# Altium project customboard_v1.PrjPcb
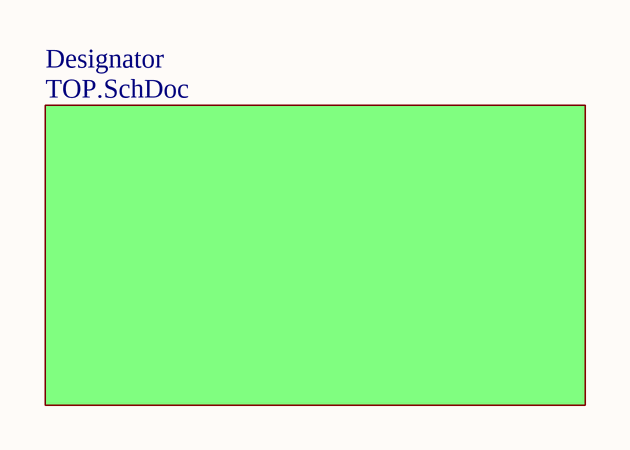
[diagram p0: project_overview.SchDoc]
5 sheets, 192 parts. Net scope: flat (ports and power ports of the same name join across sheets).
Sheets:
  project_overview.SchDoc
    Designator = TOP.SchDoc
      U_MCU = mcu.SchDoc
      U_Memory = sdram.SchDoc
      U_Power = power.SchDoc

## Sheet project_overview.SchDoc
size A3; SheetNumber: 1; SheetTotal: 6

### Sub-sheets
Designator = TOP.SchDoc: no entries

## Sheet TOP.SchDoc
size A3; SheetNumber: 2; SheetTotal: 6
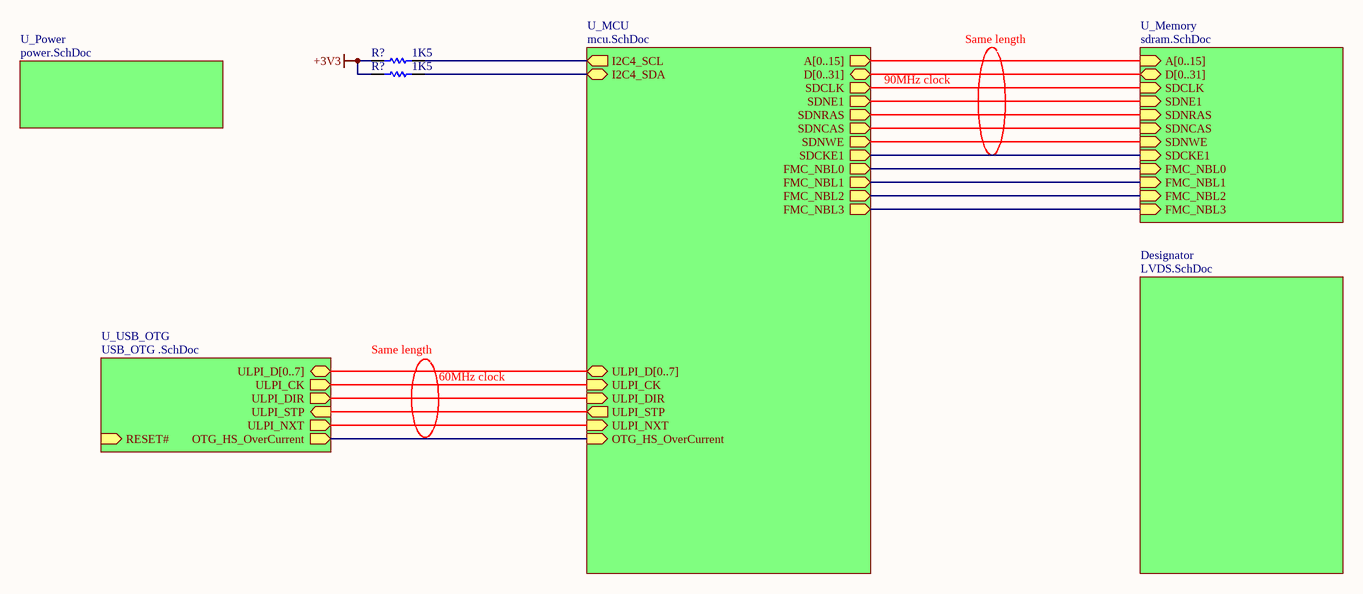
[diagram p1: TOP.SchDoc]

### Parts
(Parts that share a designator on the sheet are numbered #1, #2 ... from top to bottom, then left to right.)
R?#1  1K5  [0603R]
R?#2  1K5  [0603R]

### Sub-sheets
Designator = LVDS.SchDoc (file not in this document): no entries
U_MCU = mcu.SchDoc: ULPI_STP (out), FMC_NBL3 (out), FMC_NBL2 (out), FMC_NBL0 (out), FMC_NBL1 (out), SDNRAS (out), SDCLK (out), SDNCAS (out), SDCKE1 (out), SDNE1 (out), ULPI_NXT (in), SDNWE (out), D[0..31] (bidir), A[0..15] (out), ULPI_D[0..7] (bidir), ULPI_CK (in), I2C4_SCL (out), I2C4_SDA (bidir), OTG_HS_OverCurrent (in), ULPI_DIR (in)
U_Memory = sdram.SchDoc: FMC_NBL0 (in), FMC_NBL1 (in), D[0..31] (bidir), A[0..15] (in), SDNCAS (in), SDNWE (in), SDNRAS (in), SDNE1 (in), SDCKE1 (in), SDCLK (in), FMC_NBL3 (in), FMC_NBL2 (in)
U_Power = power.SchDoc: no entries
U_USB_OTG = USB_OTG .SchDoc (file not in this document): ULPI_D[0..7] (bidir), ULPI_CK (out), ULPI_DIR (out), ULPI_NXT (out), ULPI_STP (in), RESET# (in), OTG_HS_OverCurrent (out)

### Nets
+3V3: R?#1.1 R?#2.1
NetR?#1_2: R?#1.2 ; sheet U_MCU/I2C4_SCL
NetR?#2_2: R?#2.2 ; sheet U_MCU/I2C4_SDA
(unnamed): sheet U_MCU/ULPI_STP, sheet U_USB_OTG/ULPI_STP
(unnamed): sheet U_MCU/FMC_NBL3, sheet U_Memory/FMC_NBL3
(unnamed): sheet U_MCU/FMC_NBL2, sheet U_Memory/FMC_NBL2
(unnamed): sheet U_MCU/FMC_NBL0, sheet U_Memory/FMC_NBL0
(unnamed): sheet U_MCU/FMC_NBL1, sheet U_Memory/FMC_NBL1
(unnamed): sheet U_MCU/SDNRAS, sheet U_Memory/SDNRAS
(unnamed): sheet U_MCU/SDCLK, sheet U_Memory/SDCLK
(unnamed): sheet U_MCU/SDNCAS, sheet U_Memory/SDNCAS
(unnamed): sheet U_MCU/SDCKE1, sheet U_Memory/SDCKE1
(unnamed): sheet U_MCU/SDNE1, sheet U_Memory/SDNE1
(unnamed): sheet U_MCU/ULPI_NXT, sheet U_USB_OTG/ULPI_NXT
(unnamed): sheet U_MCU/SDNWE, sheet U_Memory/SDNWE
(unnamed): sheet U_MCU/ULPI_CK, sheet U_USB_OTG/ULPI_CK
(unnamed): sheet U_MCU/OTG_HS_OverCurrent, sheet U_USB_OTG/OTG_HS_OverCurrent
(unnamed): sheet U_MCU/ULPI_DIR, sheet U_USB_OTG/ULPI_DIR

### Buses and harness runs
bus sheet U_MCU/A[0..15] = sheet U_Memory/A[0..15]
bus sheet U_MCU/D[0..31] = sheet U_Memory/D[0..31]
bus sheet U_MCU/ULPI_D[0..7] = sheet U_USB_OTG/ULPI_D[0..7]

### Notes on the sheet
- 90MHz clock
- Same length
- 60MHz clock

### Library data of the parts
R?#1 R?#2 = Res1: Resistor; Value: 1K; Published: 8-Jun-2000; Revision: July-2002: Re-released for DXP Platform.; Publisher: Altium Limited

## Sheet mcu.SchDoc
size A3; SheetNumber: 3; SheetTotal: 5
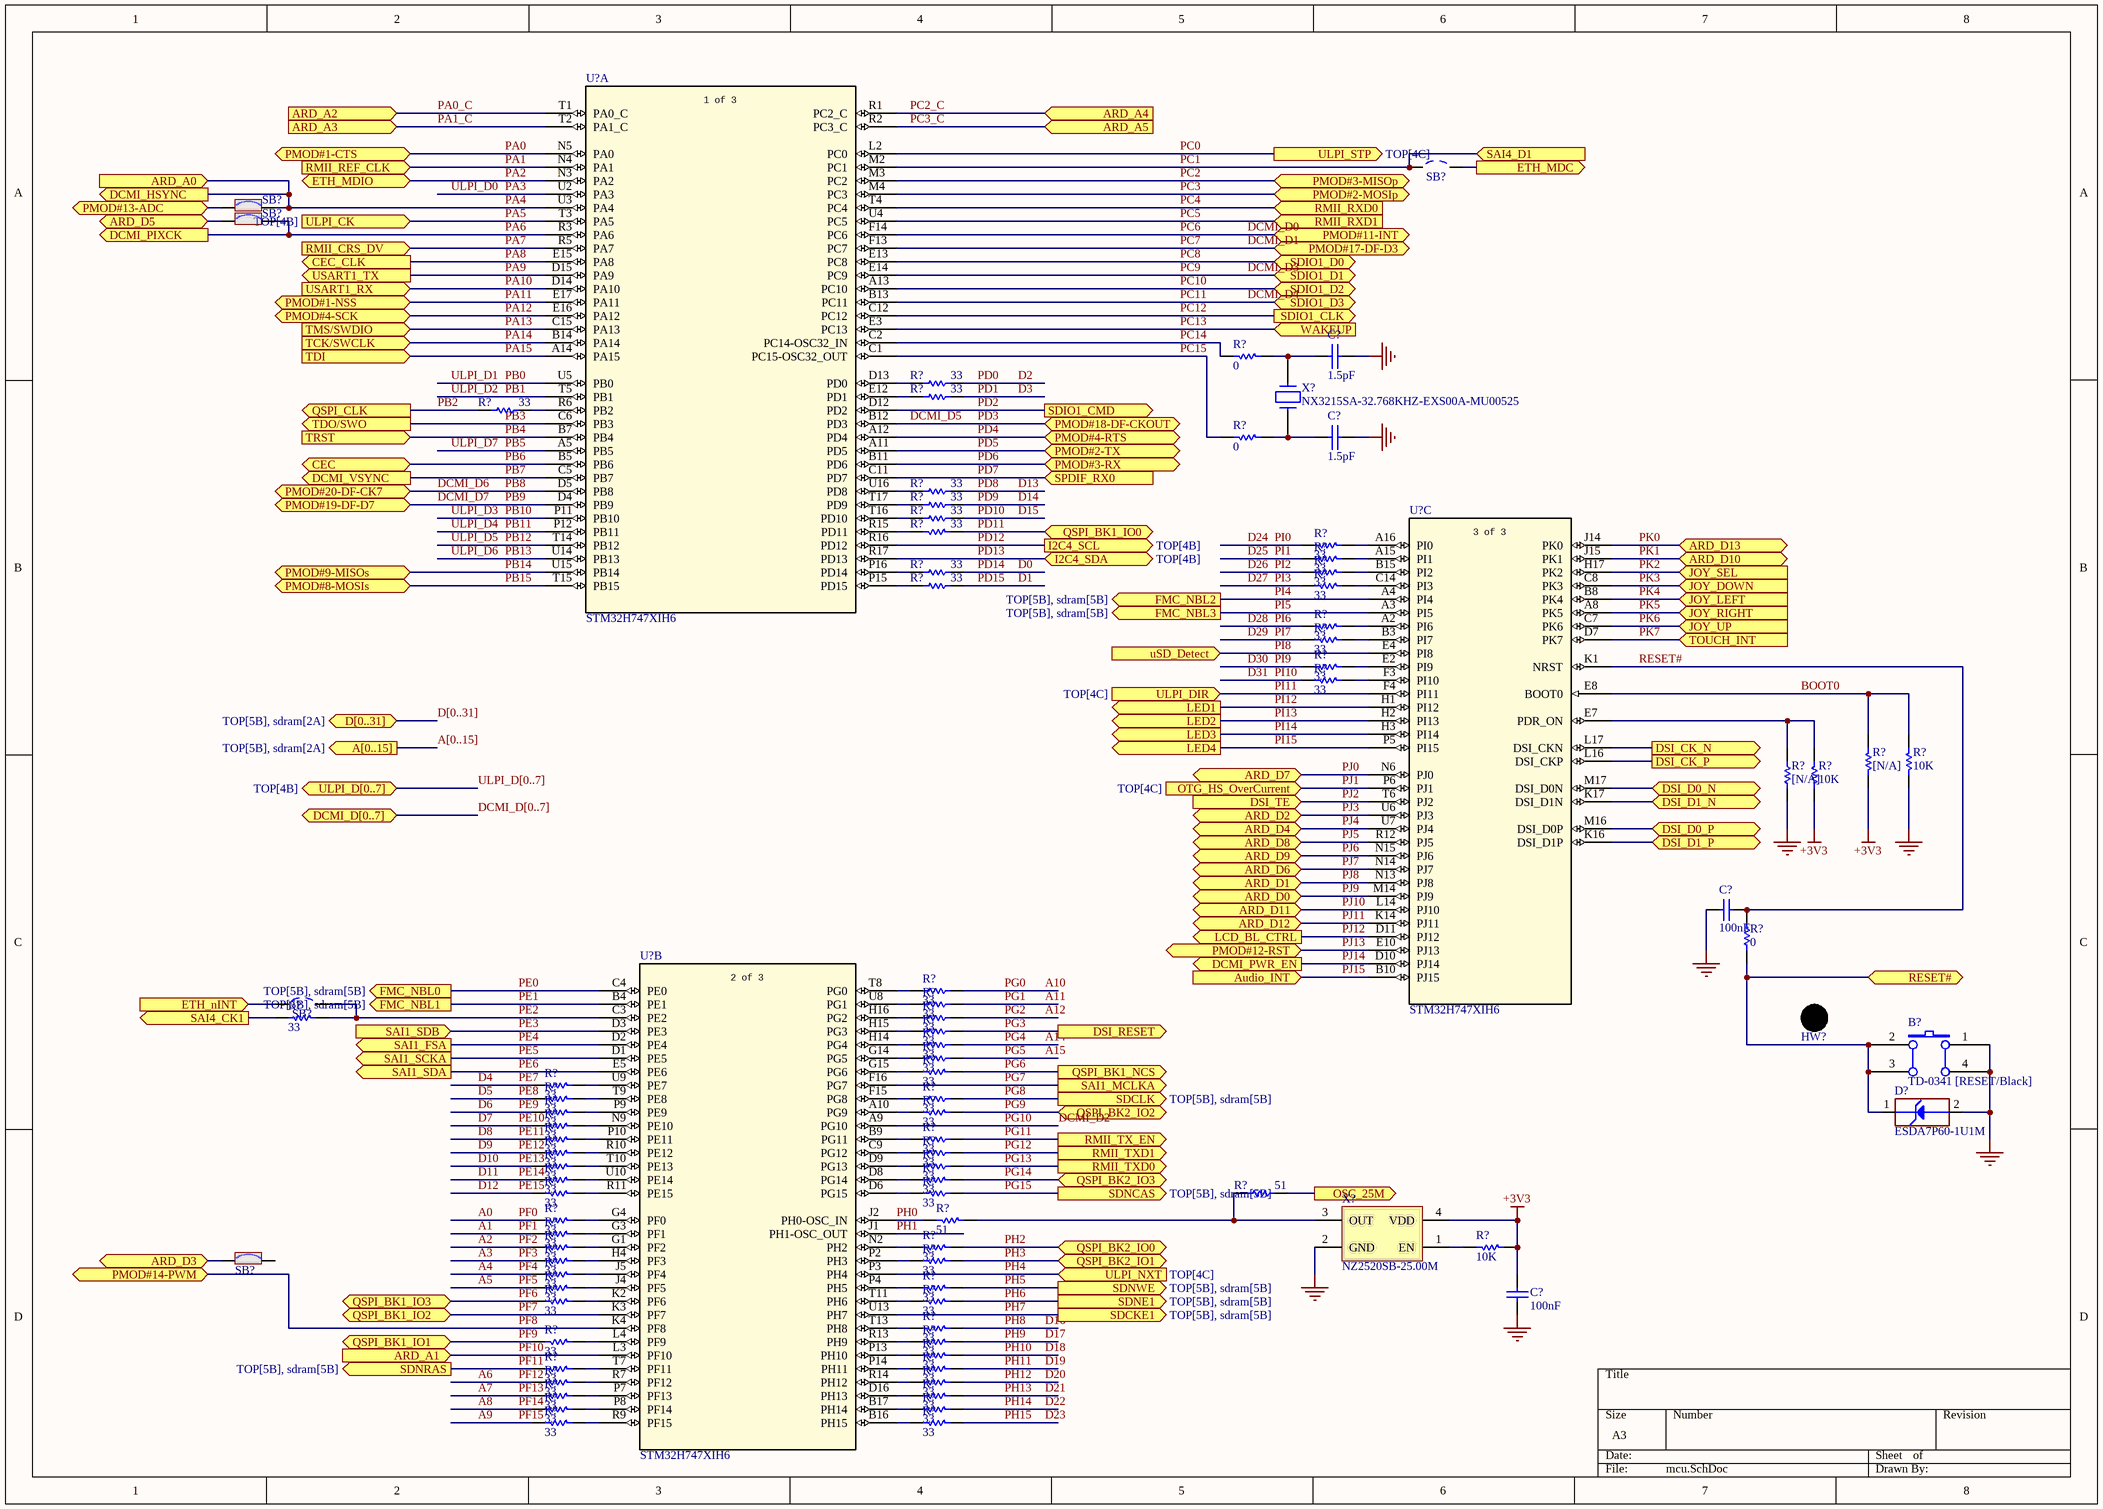
[diagram p2: mcu.SchDoc]

### Parts
(Parts that share a designator on the sheet are numbered #1, #2 ... from top to bottom, then left to right.)
B?  TD-0341 [RESET/Black]  [PB10]
C?#1  1.5pF  [CAP_C_1608X80]
C?#2  1.5pF  [CAP_C_1608X80]
C?#3  100nF  [CAP_C_1608X80]
C?#4  100nF  [CAP_C_1608X80]
D?  ESDA7P60-1U1M  [DIODE_ESDALC6V1-1U2]
HW?  SW-CAP-Black  (value not drawn)  (mechanical)
R?#3  0  [0402R]
R?#4  33  [0402R]
R?#5  33  [0402R]
R?#6  33  [0402R]
R?#7  0  [0402R]
R?#8  33  [0402R]
R?#9  33  [0402R]
R?#10  33  [0402R]
R?#11  33  [0402R]
R?#12  33  [0402R]
R?#13  33  [0402R]
R?#14  33  [0402R]
R?#15  33  [0402R]
R?#16  33  [0402R]
R?#17  33  [0402R]
R?#18  33  [0402R]
R?#19  33  [0402R]
R?#20  33  [0402R]
R?#21  33  [0402R]
R?#22  10K  [0603R]
R?#23  [N/A]  [0603R]
R?#24  [N/A]  [0603R]
R?#25  10K  [0603R]
R?#26  0  [0603R]
R?#27  33  [0402R]
R?#28  33  [0402R]
R?#29  33  [0402R]
R?#30  33  [0402R]
R?#31  33  [0402R]
R?#32  33  [0402R]
R?#33  33  [0402R]
R?#34  33  [0402R]
R?#35  33  [0402R]
R?#36  33  [0402R]
R?#37  33  [0402R]
R?#38  33  [0402R]
R?#39  33  [0402R]
R?#40  33  [0402R]
R?#41  33  [0402R]
R?#42  33  [0603R]
R?#43  33  [0402R]
R?#44  33  [0603R]
R?#45  33  [0402R]
R?#46  33  [0603R]
R?#47  33  [0402R]
R?#48  33  [0402R]
R?#49  33  [0402R]
R?#50  33  [0402R]
R?#51  51  [0603R]
R?#52  33  [0402R]
R?#53  51  [0603R]
R?#54  10K  [0603R]
R?#55  33  [0402R]
R?#56  33  [0402R]
R?#57  33  [0402R]
R?#58  33  [0402R]
R?#59  33  [0402R]
R?#60  33  [0402R]
R?#61  33  [0402R]
R?#62  33  [0402R]
R?#63  33  [0402R]
R?#64  33  [0402R]
R?#65  33  [0402R]
R?#66  33  [0402R]
R?#67  33  [0402R]
R?#68  33  [0402R]
R?#69  33  [0402R]
R?#70  33  [0402R]
R?#71  33  [0402R]
R?#72  33  [0402R]
R?#73  33  [0402R]
R?#74  33  [0402R]
R?#75  33  [0402R]
R?#76  33  [0402R]
R?#77  33  [0402R]
R?#78  33  [0402R]
SB?#1  Solder Bridge OFF  [SB_0603]  (value not drawn)
SB?#2  Solder Bridge ON  [Jump2]  (value not drawn)
SB?#3  Solder Bridge ON  [Jump2]  (value not drawn)
SB?#4  Solder Bridge OFF  [SB_0603]  (value not drawn)
SB?#5  Solder Bridge ON  [Jump2]  (value not drawn)
U?#1  STM32H747XIH6  [TFBGA240+25]  (part A of 4)
U?#2  STM32H747XIH6  [TFBGA240+25]  (part C of 4)
U?#3  STM32H747XIH6  [TFBGA240+25]  (part B of 4)
X?#1  NX3215SA-32.768KHZ-EXS00A-MU00525  [XTAL_MU00525_NDK]
X?#2  NZ2520SB-25.00M  [OSC_4SM_2R5X2]

### Ports
A[0..15] (out, see TOP[5B], sdram[2A]), ARD_A0 (in), ARD_A1 (in), ARD_A2 (in), ARD_A3 (in), ARD_A4 (in), ARD_A5 (in), ARD_D0 (bidir), ARD_D1 (bidir), ARD_D2 (bidir), ARD_D3 (bidir), ARD_D4 (bidir), ARD_D5 (bidir), ARD_D6 (bidir), ARD_D7 (bidir), ARD_D8 (bidir), ARD_D9 (bidir), ARD_D10 (bidir), ARD_D11 (bidir), ARD_D12 (bidir), ARD_D13 (bidir), Audio_INT (in), CEC (bidir), CEC_CLK (out), D[0..31] (bidir, see TOP[5B], sdram[2A]), DCMI_D[0..7] (bidir), DCMI_HSYNC (out), DCMI_PIXCK (out), DCMI_PWR_EN (out), DCMI_VSYNC (out), DSI_CK_N (out), DSI_CK_P (out), DSI_D0_N (bidir), DSI_D0_P (bidir), DSI_D1_N (bidir), DSI_D1_P (bidir), DSI_RESET (out), DSI_TE (in), ETH_MDC (out), ETH_MDIO (bidir), ETH_nINT (in), FMC_NBL0 (out, see TOP[5B], sdram[5B]), FMC_NBL1 (out, see TOP[5B], sdram[5B]), FMC_NBL2 (out, see TOP[5B], sdram[5B]), FMC_NBL3 (out, see TOP[5B], sdram[5B]), I2C4_SCL (out, see TOP[4B]), I2C4_SDA (bidir, see TOP[4B]), JOY_DOWN (in), JOY_LEFT (in), JOY_RIGHT (in), JOY_SEL (in), JOY_UP (in), LCD_BL_CTRL (out), LED1 (out), LED2 (out), LED3 (out), LED4 (out), OSC_25M (out), OTG_HS_OverCurrent (in, see TOP[4C]), PMOD#1-CTS (bidir), PMOD#1-NSS (bidir), PMOD#2-MOSIp (bidir), PMOD#2-TX (bidir), PMOD#3-MISOp (bidir), PMOD#3-RX (bidir), PMOD#4-RTS (bidir), PMOD#4-SCK (bidir), PMOD#8-MOSIs (bidir), PMOD#9-MISOs (bidir), PMOD#11-INT (bidir), PMOD#12-RST (bidir), PMOD#13-ADC (bidir), PMOD#14-PWM (bidir), PMOD#17-DF-D3 (bidir), PMOD#18-DF-CKOUT (bidir), PMOD#19-DF-D7 (bidir), PMOD#20-DF-CK7 (bidir), QSPI_BK1_IO0 (bidir), QSPI_BK1_IO1 (bidir), QSPI_BK1_IO2 (bidir), QSPI_BK1_IO3 (bidir), QSPI_BK1_NCS (out), QSPI_BK2_IO0 (bidir), QSPI_BK2_IO1 (bidir), QSPI_BK2_IO2 (bidir), QSPI_BK2_IO3 (bidir), QSPI_CLK (out), RESET# (bidir), RMII_CRS_DV (in), RMII_REF_CLK (in), RMII_RXD0 (in), RMII_RXD1 (in), RMII_TX_EN (out), RMII_TXD0 (out), RMII_TXD1 (out), SAI1_FSA (out), SAI1_MCLKA (out), SAI1_SCKA (out), SAI1_SDA (out), SAI1_SDB (in), SAI4_CK1 (out), SAI4_D1 (in), SDCKE1 (out, see TOP[5B], sdram[5B]), SDCLK (out, see TOP[5B], sdram[5B]), SDIO1_CLK (out), SDIO1_CMD (out), SDIO1_D0 (bidir), SDIO1_D1 (bidir), SDIO1_D2 (bidir), SDIO1_D3 (bidir), SDNCAS (out, see TOP[5B], sdram[5B]), SDNE1 (out, see TOP[5B], sdram[5B]), SDNRAS (out, see TOP[5B], sdram[5B]), SDNWE (out, see TOP[5B], sdram[5B]), SPDIF_RX0 (in), TCK/SWCLK (in), TDI (in), TDO/SWO (out), TMS/SWDIO (in), TOUCH_INT (in), TRST (in), ULPI_CK (in, see TOP[4B]), ULPI_D[0..7] (bidir, see TOP[4B]), ULPI_DIR (in, see TOP[4C]), ULPI_NXT (in, see TOP[4C]), ULPI_STP (out, see TOP[4C]), USART1_RX (in), USART1_TX (out), uSD_Detect (in), WAKEUP (in)

### Nets
+3V3: C?#4.2 R?#24.1 R?#25.1 R?#54.1 X?#2.4(VDD)
GND: B?.1(A0) B?.4(A1) C?#1.2 C?#2.2 C?#3.1 C?#4.1 D?.2(GND) R?#22.2 R?#23.2 X?#2.2(GND)
A0: R?#52.1  [also labelled PF0]
A1: R?#55.1  [also labelled PF1]
A2: R?#56.1  [also labelled PF2]
A3: R?#58.1  [also labelled PF3]
A4: R?#60.1  [also labelled PF4]
A5: R?#61.1  [also labelled PF5]
A6: R?#71.1  [also labelled PF12]
A7: R?#73.1  [also labelled PF13]
A8: R?#75.1  [also labelled PF14]
A9: R?#77.1  [also labelled PF15]
A10: R?#27.1  [also labelled PG0]
A11: R?#28.1  [also labelled PG1]
A12: R?#30.1  [also labelled PG2]
A14: R?#32.1  [also labelled PG4]
A15: R?#33.1  [also labelled PG5]
BOOT0: R?#22.1 R?#24.2 U?#2.E8(BOOT0)
D0: R?#14.1  [also labelled PD14]
D1: R?#16.1  [also labelled PD15]
D2: R?#4.1  [also labelled PD0]
D3: R?#5.1  [also labelled PD1]
D4: R?#35.1  [also labelled PE7]
D5: R?#36.1  [also labelled PE8]
D6: R?#38.1  [also labelled PE9]
D7: R?#40.1  [also labelled PE10]
D8: R?#41.1  [also labelled PE11]
D9: R?#43.1  [also labelled PE12]
D10: R?#45.1  [also labelled PE13]
D11: R?#47.1  [also labelled PE14]
D12: R?#49.1  [also labelled PE15]
D13: R?#8.1  [also labelled PD8]
D14: R?#9.1  [also labelled PD9]
D15: R?#10.1  [also labelled PD10]
D16: R?#65.2  [also labelled PH8]
D17: R?#67.2  [also labelled PH9]
D18: R?#68.2  [also labelled PH10]
D19: R?#70.2  [also labelled PH11]
D20: R?#72.2  [also labelled PH12]
D21: R?#74.2  [also labelled PH13]
D22: R?#76.2  [also labelled PH14]
D23: R?#78.2  [also labelled PH15]
D24: R?#12.1  [also labelled PI0]
D25: R?#13.1  [also labelled PI1]
D26: R?#15.1  [also labelled PI2]
D27: R?#17.1  [also labelled PI3]
D28: R?#18.1  [also labelled PI6]
D29: R?#19.1  [also labelled PI7]
D30: R?#20.1  [also labelled PI9]
D31: R?#21.1  [also labelled PI10]
DCMI_D0: U?#1.F14(PC6) ; port PMOD#11-INT  [also labelled PC6]
DCMI_D1: U?#1.F13(PC7) ; port PMOD#17-DF-D3  [also labelled PC7]
DCMI_D2: U?#3.A9(PG10)  [also labelled PG10]
DCMI_D3: U?#1.E14(PC9) ; port SDIO1_D1  [also labelled PC9]
DCMI_D4: U?#1.B13(PC11) ; port SDIO1_D3  [also labelled PC11]
DCMI_D5: U?#1.B12(PD3) ; port PMOD#18-DF-CKOUT  [also labelled PD3]
DCMI_D6: U?#1.D5(PB8) ; port PMOD#20-DF-CK7  [also labelled PB8]
DCMI_D7: U?#1.D4(PB9) ; port PMOD#19-DF-D7  [also labelled PB9]
PA0: U?#1.N5(PA0) ; port PMOD#1-CTS
PA0_C: U?#1.T1(PA0_C) ; port ARD_A2
PA1: U?#1.N4(PA1) ; port RMII_REF_CLK
PA1_C: U?#1.T2(PA1_C) ; port ARD_A3
PA2: U?#1.N3(PA2) ; port ETH_MDIO
PA3: U?#1.U2(PA3)  [also labelled ULPI_D0]
PA4: SB?#2.2 U?#1.U3(PA4) ; port DCMI_HSYNC, port ARD_A0
PA5: U?#1.T3(PA5) ; port ULPI_CK
PA6: SB?#3.2 U?#1.R3(PA6) ; port DCMI_PIXCK
PA7: U?#1.R5(PA7) ; port RMII_CRS_DV
PA8: U?#1.E15(PA8) ; port CEC_CLK
PA9: U?#1.D15(PA9) ; port USART1_TX
PA10: U?#1.D14(PA10) ; port USART1_RX
PA11: U?#1.E17(PA11) ; port PMOD#1-NSS
PA12: U?#1.E16(PA12) ; port PMOD#4-SCK
PA13: U?#1.C15(PA13) ; port TMS/SWDIO
PA14: U?#1.B14(PA14) ; port TCK/SWCLK
PA15: U?#1.A14(PA15) ; port TDI
PB0: U?#1.U5(PB0)  [also labelled ULPI_D1]
PB1: U?#1.T5(PB1)  [also labelled ULPI_D2]
PB2: R?#6.2 ; port QSPI_CLK
PB3: U?#1.C6(PB3) ; port TDO/SWO
PB4: U?#1.B7(PB4) ; port TRST
PB5: U?#1.A5(PB5)  [also labelled ULPI_D7]
PB6: U?#1.B5(PB6) ; port CEC
PB7: U?#1.C5(PB7) ; port DCMI_VSYNC
PB10: U?#1.P11(PB10)  [also labelled ULPI_D3]
PB11: U?#1.P12(PB11)  [also labelled ULPI_D4]
PB12: U?#1.T14(PB12)  [also labelled ULPI_D5]
PB13: U?#1.U14(PB13)  [also labelled ULPI_D6]
PB14: U?#1.U15(PB14) ; port PMOD#9-MISOs
PB15: U?#1.T15(PB15) ; port PMOD#8-MOSIs
PC0: U?#1.L2(PC0) ; port ULPI_STP
PC1: SB?#1.2 U?#1.M2(PC1) ; port SAI4_D1
PC2: U?#1.M3(PC2) ; port PMOD#3-MISOp
PC2_C: U?#1.R1(PC2_C) ; port ARD_A4
PC3: U?#1.M4(PC3) ; port PMOD#2-MOSIp
PC3_C: U?#1.R2(PC3_C) ; port ARD_A5
PC4: U?#1.T4(PC4) ; port RMII_RXD0
PC5: U?#1.U4(PC5) ; port RMII_RXD1
PC8: U?#1.E13(PC8) ; port SDIO1_D0
PC10: U?#1.A13(PC10) ; port SDIO1_D2
PC12: U?#1.C12(PC12) ; port SDIO1_CLK
PC13: U?#1.E3(PC13) ; port WAKEUP
PC14: R?#3.2 U?#1.C2(PC14-OSC32_IN)
PC15: R?#7.2 U?#1.C1(PC15-OSC32_OUT)
PD2: U?#1.D12(PD2) ; port SDIO1_CMD
PD4: U?#1.A12(PD4) ; port PMOD#4-RTS
PD5: U?#1.A11(PD5) ; port PMOD#2-TX
PD6: U?#1.B11(PD6) ; port PMOD#3-RX
PD7: U?#1.C11(PD7) ; port SPDIF_RX0
PD11: R?#11.2 ; port QSPI_BK1_IO0
PD12: U?#1.R16(PD12) ; port I2C4_SCL
PD13: U?#1.R17(PD13) ; port I2C4_SDA
PE0: U?#3.C4(PE0) ; port FMC_NBL0
PE1: U?#3.B4(PE1) ; port FMC_NBL1
PE2: R?#29.2 SB?#4.1 U?#3.C3(PE2)
PE3: U?#3.D3(PE3) ; port SAI1_SDB
PE4: U?#3.D2(PE4) ; port SAI1_FSA
PE5: U?#3.D1(PE5) ; port SAI1_SCKA
PE6: U?#3.E5(PE6) ; port SAI1_SDA
PF6: R?#63.1 ; port QSPI_BK1_IO3
PF7: U?#3.K3(PF7) ; port QSPI_BK1_IO2
PF8: U?#3.K4(PF8) ; port PMOD#14-PWM
PF9: R?#66.1 ; port QSPI_BK1_IO1
PF10: U?#3.L3(PF10) ; port ARD_A1
PF11: R?#69.1 ; port SDNRAS
PG3: R?#31.1 ; port DSI_RESET
PG6: R?#34.2 ; port QSPI_BK1_NCS
PG7: U?#3.F16(PG7) ; port SAI1_MCLKA
PG8: R?#37.1 ; port SDCLK
PG9: R?#39.2 ; port QSPI_BK2_IO2
PG11: R?#42.1 ; port RMII_TX_EN
PG12: R?#44.1 ; port RMII_TXD1
PG13: R?#46.1 ; port RMII_TXD0
PG14: R?#48.2 ; port QSPI_BK2_IO3
PG15: R?#50.1 ; port SDNCAS
PH0: R?#53.1 U?#3.J2(PH0-OSC_IN)
PH1: U?#3.J1(PH1-OSC_OUT)
PH2: R?#57.2 ; port QSPI_BK2_IO0
PH3: R?#59.2 ; port QSPI_BK2_IO1
PH4: U?#3.P3(PH4) ; port ULPI_NXT
PH5: R?#62.2 ; port SDNWE
PH6: R?#64.2 ; port SDNE1
PH7: U?#3.U13(PH7) ; port SDCKE1
PI4: U?#2.A4(PI4) ; port FMC_NBL2
PI5: U?#2.A3(PI5) ; port FMC_NBL3
PI8: U?#2.E4(PI8) ; port uSD_Detect
PI11: U?#2.F4(PI11) ; port ULPI_DIR
PI12: U?#2.H1(PI12) ; port LED1
PI13: U?#2.H2(PI13) ; port LED2
PI14: U?#2.H3(PI14) ; port LED3
PI15: U?#2.P5(PI15) ; port LED4
PJ0: U?#2.N6(PJ0) ; port ARD_D7
PJ1: U?#2.P6(PJ1) ; port OTG_HS_OverCurrent
PJ2: U?#2.T6(PJ2) ; port DSI_TE
PJ3: U?#2.U6(PJ3) ; port ARD_D2
PJ4: U?#2.U7(PJ4) ; port ARD_D4
PJ5: U?#2.R12(PJ5) ; port ARD_D8
PJ6: U?#2.N15(PJ6) ; port ARD_D9
PJ7: U?#2.N14(PJ7) ; port ARD_D6
PJ8: U?#2.N13(PJ8) ; port ARD_D1
PJ9: U?#2.M14(PJ9) ; port ARD_D0
PJ10: U?#2.L14(PJ10) ; port ARD_D11
PJ11: U?#2.K14(PJ11) ; port ARD_D12
PJ12: U?#2.D11(PJ12) ; port LCD_BL_CTRL
PJ13: U?#2.E10(PJ13) ; port PMOD#12-RST
PJ14: U?#2.D10(PJ14) ; port DCMI_PWR_EN
PJ15: U?#2.B10(PJ15) ; port Audio_INT
PK0: U?#2.J14(PK0) ; port ARD_D13
PK1: U?#2.J15(PK1) ; port ARD_D10
PK2: U?#2.H17(PK2) ; port JOY_SEL
PK3: U?#2.C8(PK3) ; port JOY_DOWN
PK4: U?#2.B8(PK4) ; port JOY_LEFT
PK5: U?#2.A8(PK5) ; port JOY_RIGHT
PK6: U?#2.C7(PK6) ; port JOY_UP
PK7: U?#2.D7(PK7) ; port TOUCH_INT
RESET#: C?#3.2 R?#26.1 U?#2.K1(NRST)
NetB?_2: B?.2(B0) B?.3(B1) D?.1(IO1) R?#26.2 ; port RESET#
NetC?#1_1: C?#1.1 R?#3.1 X?#1.2
NetC?#2_1: C?#2.1 R?#7.1 X?#1.1
NetR?#4_2: R?#4.2 U?#1.D13(PD0)
NetR?#5_2: R?#5.2 U?#1.E12(PD1)
NetR?#6_1: R?#6.1 U?#1.R6(PB2)
NetR?#8_2: R?#8.2 U?#1.U16(PD8)
NetR?#9_2: R?#9.2 U?#1.T17(PD9)
NetR?#10_2: R?#10.2 U?#1.T16(PD10)
NetR?#11_1: R?#11.1 U?#1.R15(PD11)
NetR?#12_2: R?#12.2 U?#2.A16(PI0)
NetR?#13_2: R?#13.2 U?#2.A15(PI1)
NetR?#14_2: R?#14.2 U?#1.P16(PD14)
NetR?#15_2: R?#15.2 U?#2.B15(PI2)
NetR?#16_2: R?#16.2 U?#1.P15(PD15)
NetR?#17_2: R?#17.2 U?#2.C14(PI3)
NetR?#18_2: R?#18.2 U?#2.A2(PI6)
NetR?#19_2: R?#19.2 U?#2.B3(PI7)
NetR?#20_2: R?#20.2 U?#2.E2(PI9)
NetR?#21_2: R?#21.2 U?#2.F3(PI10)
NetR?#23_1: R?#23.1 R?#25.2 U?#2.E7(PDR_ON)
NetR?#27_2: R?#27.2 U?#3.T8(PG0)
NetR?#28_2: R?#28.2 U?#3.U8(PG1)
NetR?#29_1: R?#29.1 ; port SAI4_CK1
NetR?#30_2: R?#30.2 U?#3.H16(PG2)
NetR?#31_2: R?#31.2 U?#3.H15(PG3)
NetR?#32_2: R?#32.2 U?#3.H14(PG4)
NetR?#33_2: R?#33.2 U?#3.G14(PG5)
NetR?#34_1: R?#34.1 U?#3.G15(PG6)
NetR?#35_2: R?#35.2 U?#3.U9(PE7)
NetR?#36_2: R?#36.2 U?#3.T9(PE8)
NetR?#37_2: R?#37.2 U?#3.F15(PG8)
NetR?#38_2: R?#38.2 U?#3.P9(PE9)
NetR?#39_1: R?#39.1 U?#3.A10(PG9)
NetR?#40_2: R?#40.2 U?#3.N9(PE10)
NetR?#41_2: R?#41.2 U?#3.P10(PE11)
NetR?#42_2: R?#42.2 U?#3.B9(PG11)
NetR?#43_2: R?#43.2 U?#3.R10(PE12)
NetR?#44_2: R?#44.2 U?#3.C9(PG12)
NetR?#45_2: R?#45.2 U?#3.T10(PE13)
NetR?#46_2: R?#46.2 U?#3.D9(PG13)
NetR?#47_2: R?#47.2 U?#3.U10(PE14)
NetR?#48_1: R?#48.1 U?#3.D8(PG14)
NetR?#49_2: R?#49.2 U?#3.R11(PE15)
NetR?#50_2: R?#50.2 U?#3.D6(PG15)
NetR?#51_1: R?#51.1 ; port OSC_25M
NetR?#51_2: R?#51.2 R?#53.2 X?#2.3(OUT)
NetR?#52_2: R?#52.2 U?#3.G4(PF0)
NetR?#54_2: R?#54.2 X?#2.1(EN)
NetR?#55_2: R?#55.2 U?#3.G3(PF1)
NetR?#56_2: R?#56.2 U?#3.G1(PF2)
NetR?#57_1: R?#57.1 U?#3.N2(PH2)
NetR?#58_2: R?#58.2 U?#3.H4(PF3)
NetR?#59_1: R?#59.1 U?#3.P2(PH3)
NetR?#60_2: R?#60.2 U?#3.J5(PF4)
NetR?#61_2: R?#61.2 U?#3.J4(PF5)
NetR?#62_1: R?#62.1 U?#3.P4(PH5)
NetR?#63_2: R?#63.2 U?#3.K2(PF6)
NetR?#64_1: R?#64.1 U?#3.T11(PH6)
NetR?#65_1: R?#65.1 U?#3.T13(PH8)
NetR?#66_2: R?#66.2 U?#3.L4(PF9)
NetR?#67_1: R?#67.1 U?#3.R13(PH9)
NetR?#68_1: R?#68.1 U?#3.P13(PH10)
NetR?#69_2: R?#69.2 U?#3.T7(PF11)
NetR?#70_1: R?#70.1 U?#3.P14(PH11)
NetR?#71_2: R?#71.2 U?#3.R7(PF12)
NetR?#72_1: R?#72.1 U?#3.R14(PH12)
NetR?#73_2: R?#73.2 U?#3.P7(PF13)
NetR?#74_1: R?#74.1 U?#3.D16(PH13)
NetR?#75_2: R?#75.2 U?#3.P8(PF14)
NetR?#76_1: R?#76.1 U?#3.B17(PH14)
NetR?#77_2: R?#77.2 U?#3.R9(PF15)
NetR?#78_1: R?#78.1 U?#3.B16(PH15)
NetSB?#1_1: SB?#1.1 ; port ETH_MDC
NetSB?#2_1: SB?#2.1 ; port PMOD#13-ADC
NetSB?#3_1: SB?#3.1 ; port ARD_D5
NetSB?#4_2: SB?#4.2 ; port ETH_nINT
NetSB?#5_2: SB?#5.2 ; port ARD_D3
NetU?#2_K16: U?#2.K16(DSI_D1P) ; port DSI_D1_P
NetU?#2_K17: U?#2.K17(DSI_D1N) ; port DSI_D1_N
NetU?#2_L16: U?#2.L16(DSI_CKP) ; port DSI_CK_P
NetU?#2_L17: U?#2.L17(DSI_CKN) ; port DSI_CK_N
NetU?#2_M16: U?#2.M16(DSI_D0P) ; port DSI_D0_P
NetU?#2_M17: U?#2.M17(DSI_D0N) ; port DSI_D0_N

Not connected (* = marked no-connect by the designer): SB?#5 1

### Buses and harness runs
bus A[0..15] = port A[0..15]
bus D[0..31] = port D[0..31]
bus DCMI_D[0..7] = port DCMI_D[0..7]
bus ULPI_D[0..7] = port ULPI_D[0..7]

### Notes on the sheet
- (in symbol STM32H747XIH6, part A) 1 of 3
- (in symbol STM32H747XIH6, part B) 2 of 3
- (in symbol STM32H747XIH6, part C) 3 of 3

### Library data of the parts
B? = SW PUSHBUTTON: SE PUSHBUTTON
C?#1 C?#2 C?#4 = CAP: Capacitor
  C?#4: Published: 8-Jun-2000; Revision: July-2002: Re-released for DXP Platform.; Publisher: Altium Limited; Value: 100nF
C?#3 = CAP: Capacitor; Value: 100pF; Published: 8-Jun-2000; Revision: July-2002: Re-released for DXP Platform.; Publisher: Altium Limited
D? = ESDALC6V1-1U2: Dual Transil array for ESD protection; Manuf_1: STM; Ref St: .; ECCN_US/EU: EAR99/NEC; Fitted: YES; Provided: ST; Manuf_Part_1: ESDA7P60-1U1M; Distrib: ST; Ordered by: STM; Order: ESDA7P60-1U1M
HW? = MCD-02420: Black round cap for TSS6x series; Part_Type: Mechanical; Part_Preference: Recommended; Manufacturer: KNITTER-SWITCH; Manufacturer_Part_Number: KTSC-62K; Manufacturer_HQ_COO: Unknown; Partial_Alternate_Internal_Part_Number: MCD-02526; Value: SW-CAP-KTSC-62K; Component_Country_Of_Origin: China; Alternate_EMS: M; ShowFields: YES; ID: 4526; Order_code_Digikey: N/A; Order_code_Farnell: N/A; Order_code_RS: N/A; Status: Released; ComponentLink1URL: http://tunmcdsvn.tun.st.com/Component_Documentation_Library/Trunk/Mechanical/KNITTER_SWITCH_KTSC-62_Series; Internal_Part_Number: MCD-02420
R?#3-R?#21 R?#25 R?#27-R?#53 R?#55-R?#78 = Res1: Resistor; Value: 1K; Published: 8-Jun-2000; Revision: July-2002: Re-released for DXP Platform.; Publisher: Altium Limited
R?#22 R?#26 = res1: Resistor; Value: 1K; Published: 8-Jun-2000; Revision: July-2002: Re-released for DXP Platform.; Publisher: Altium Limited
R?#23 R?#24 = res1: Resistor; Value: 1K; Ordered by: Subcon; ECCN_US/EU: NA; Fitted: NO; Published: 8-Jun-2000; Revision: July-2002: Re-released for DXP Platform.; Publisher: Altium Limited
R?#54 = Res_10K_1%_0402: Resistor,10K,0402,1%,YAGEO; Value: 10K; Manuf_1: YAGEO; ECCN_US/EU: n/a
SB?#1 SB?#4 = SB_OFF: Fitted: NO; Ordered by: Subcon; Revision: July-2002: Re-released for DXP Platform.; ECCN_US/EU: n/a
SB?#2 SB?#3 SB?#5 = SB_ON: Fitted: YES; Ordered by: Subcon; Revision: July-2002: Re-released for DXP Platform.; ECCN_US/EU: n/a
U?#1-U?#3 = STM32H747XIH6: High-performance and DSP with DP-FPU, Arm Cortex-M7 + Cortex-M4 MCU with 2MBytes of Flash memory, 1MB RAM, 480 MHz CPU, Art Accelerator, L1 cache, external memory interface, large set of peripherals, SMPS; Manufacturer_Name: STMicroelectronics; Copyright: Copyright (C) 2025 Ultra Librarian. All rights reserved.; Manufacturer_Part_Number: STM32H747XIH6; Datasheet: https://www.st.com/resource/en/datasheet/stm32h747ag.pdf; RefDes: RefDes; Type: Type
X?#1 = CRYSTAL_32K: Crystal; Manuf_1: NDK; ECCN_US/EU: EAR99/NEC; Ordered by: STM; Fitted: YES; Manuf_Part_1: NX3215SA-32.768KHZ-EXS00A-MU00525
X?#2 = OSC_25M_NZ2520SB: Oscillator 25.00Mhz, -+50PPM, 3.3V, Temp -55 to +125癈; Manuf_Part_1: NZ2520SB 25MHz END4869B; Manuf_1: NDK; Manuf_Part_2: KC2520B25.0000C10E00; Manuf_2: AVX Corp/Kyocera Corp; Ordered by: STM; ECCN_US/EU: EAR99/NEC; Ref St: 9157031; Fitted: YES

## Sheet sdram.SchDoc
size A3; SheetNumber: 5; SheetTotal: 5
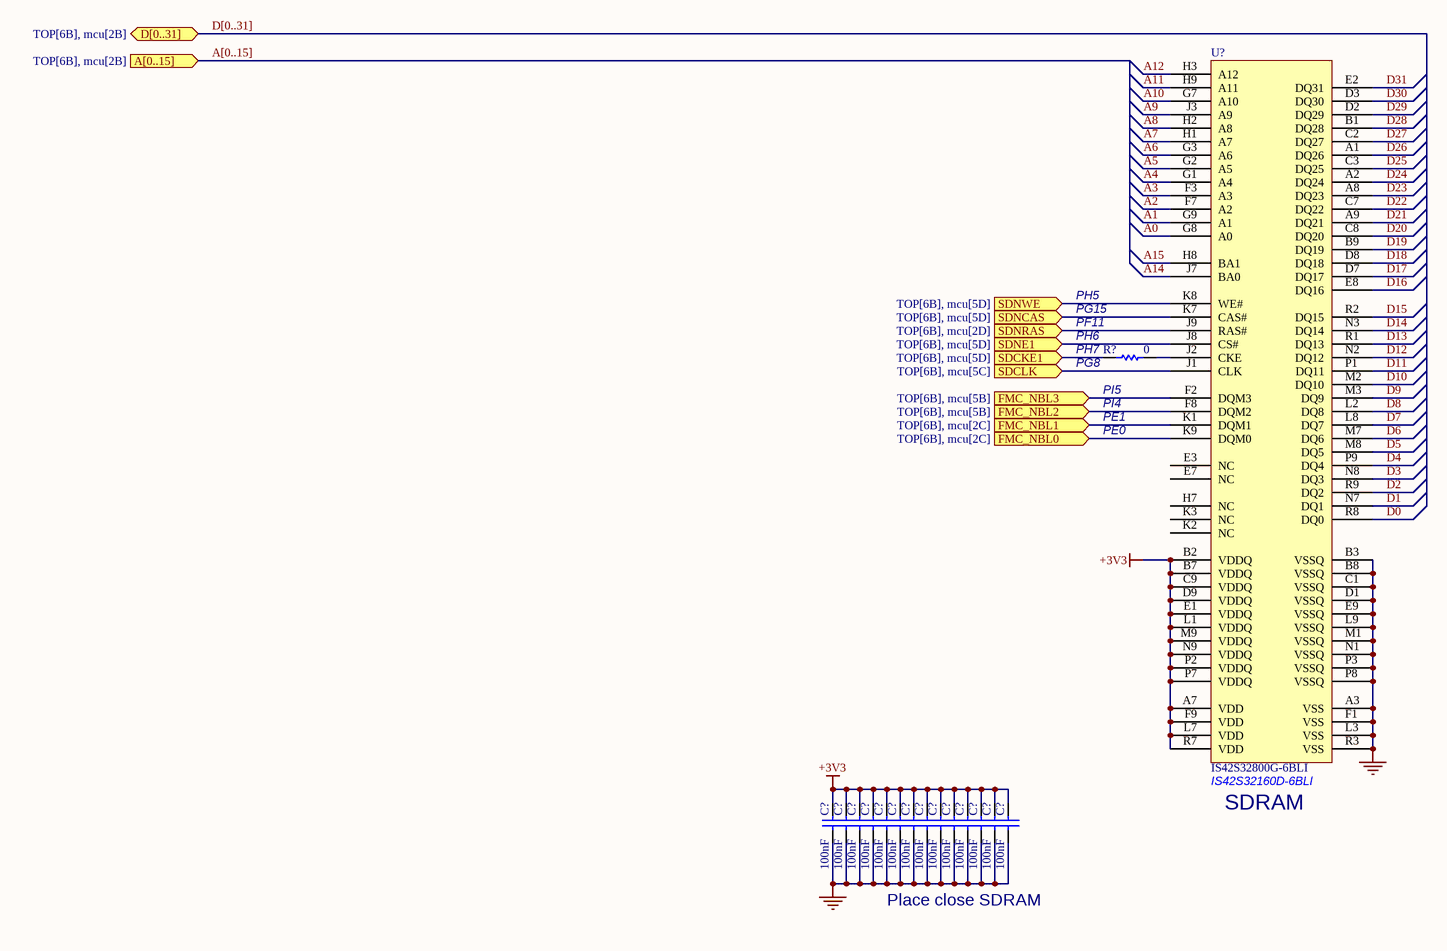
[diagram p3: sdram.SchDoc]

### Parts
(Parts that share a designator on the sheet are numbered #1, #2 ... from top to bottom, then left to right.)
C?#5  100nF  [0603C]
C?#6  100nF  [0603C]
C?#7  100nF  [0603C]
C?#8  100nF  [0603C]
C?#9  100nF  [0603C]
C?#10  100nF  [0603C]
C?#11  100nF  [0603C]
C?#12  100nF  [0603C]
C?#13  100nF  [0603C]
C?#14  100nF  [0603C]
C?#15  100nF  [0603C]
C?#16  100nF  [0603C]
C?#17  100nF  [0603C]
C?#18  100nF  [0603C]
R?#79  0  [0603R]
U?#4  IS42S32800G-6BLI  [TFBGA90_8X13]

### Ports
A[0..15] (in, see TOP[6B], mcu[2B]), D[0..31] (bidir, see TOP[6B], mcu[2B]), FMC_NBL0 (in, see TOP[6B], mcu[2C]), FMC_NBL1 (in, see TOP[6B], mcu[2C]), FMC_NBL2 (in, see TOP[6B], mcu[5B]), FMC_NBL3 (in, see TOP[6B], mcu[5B]), SDCKE1 (in, see TOP[6B], mcu[5D]), SDCLK (in, see TOP[6B], mcu[5C]), SDNCAS (in, see TOP[6B], mcu[5D]), SDNE1 (in, see TOP[6B], mcu[5D]), SDNRAS (in, see TOP[6B], mcu[2D]), SDNWE (in, see TOP[6B], mcu[5D])

### Nets
+3V3: C?#5.1 C?#6.1 C?#7.1 C?#8.1 C?#9.1 C?#10.1 C?#11.1 C?#12.1 C?#13.1 C?#14.1 C?#15.1 C?#16.1 C?#17.1 C?#18.1 U?#4.A7(VDD) U?#4.B2(VDDQ) U?#4.B7(VDDQ) U?#4.C9(VDDQ) U?#4.D9(VDDQ) U?#4.E1(VDDQ) U?#4.F9(VDD) U?#4.L1(VDDQ) U?#4.L7(VDD) U?#4.M9(VDDQ) U?#4.N9(VDDQ) U?#4.P2(VDDQ) U?#4.P7(VDDQ) U?#4.R7(VDD)
GND: C?#5.2 C?#6.2 C?#7.2 C?#8.2 C?#9.2 C?#10.2 C?#11.2 C?#12.2 C?#13.2 C?#14.2 C?#15.2 C?#16.2 C?#17.2 C?#18.2 U?#4.A3(VSS) U?#4.B3(VSSQ) U?#4.B8(VSSQ) U?#4.C1(VSSQ) U?#4.D1(VSSQ) U?#4.E9(VSSQ) U?#4.F1(VSS) U?#4.L3(VSS) U?#4.L9(VSSQ) U?#4.M1(VSSQ) U?#4.N1(VSSQ) U?#4.P3(VSSQ) U?#4.P8(VSSQ) U?#4.R3(VSS)
A0: U?#4.G8(A0)
A1: U?#4.G9(A1)
A2: U?#4.F7(A2)
A3: U?#4.F3(A3)
A4: U?#4.G1(A4)
A5: U?#4.G2(A5)
A6: U?#4.G3(A6)
A7: U?#4.H1(A7)
A8: U?#4.H2(A8)
A9: U?#4.J3(A9)
A10: U?#4.G7(A10)
A11: U?#4.H9(A11)
A12: U?#4.H3(A12)
A14: U?#4.J7(BA0)
A15: U?#4.H8(BA1)
D0: U?#4.R8(DQ0)
D1: U?#4.N7(DQ1)
D2: U?#4.R9(DQ2)
D3: U?#4.N8(DQ3)
D4: U?#4.P9(DQ4)
D5: U?#4.M8(DQ5)
D6: U?#4.M7(DQ6)
D7: U?#4.L8(DQ7)
D8: U?#4.L2(DQ8)
D9: U?#4.M3(DQ9)
D10: U?#4.M2(DQ10)
D11: U?#4.P1(DQ11)
D12: U?#4.N2(DQ12)
D13: U?#4.R1(DQ13)
D14: U?#4.N3(DQ14)
D15: U?#4.R2(DQ15)
D16: U?#4.E8(DQ16)
D17: U?#4.D7(DQ17)
D18: U?#4.D8(DQ18)
D19: U?#4.B9(DQ19)
D20: U?#4.C8(DQ20)
D21: U?#4.A9(DQ21)
D22: U?#4.C7(DQ22)
D23: U?#4.A8(DQ23)
D24: U?#4.A2(DQ24)
D25: U?#4.C3(DQ25)
D26: U?#4.A1(DQ26)
D27: U?#4.C2(DQ27)
D28: U?#4.B1(DQ28)
D29: U?#4.D2(DQ29)
D30: U?#4.D3(DQ30)
D31: U?#4.E2(DQ31)
PE0: U?#4.K9(DQM0) ; port FMC_NBL0
PE1: U?#4.K1(DQM1) ; port FMC_NBL1
PF11: U?#4.J9(RAS#) ; port SDNRAS
PG8: U?#4.J1(CLK) ; port SDCLK
PG15: U?#4.K7(CAS#) ; port SDNCAS
PH5: U?#4.K8(WE#) ; port SDNWE
PH6: U?#4.J8(CS#) ; port SDNE1
PH7: R?#79.2 ; port SDCKE1
PI4: U?#4.F8(DQM2) ; port FMC_NBL2
PI5: U?#4.F2(DQM3) ; port FMC_NBL3
NetR?#79_1: R?#79.1 U?#4.J2(CKE)

Not connected (* = marked no-connect by the designer): U?#4 E3(NC) E7(NC) H7(NC) K2(NC) K3(NC)

### Buses and harness runs
bus A[0..15] = port A[0..15]
bus D[0..31] = port D[0..31]

### Notes on the sheet
- PH5
- (near R?#79) PG15
- (near R?#79) PF11
- (near R?#79) PH6
- (near R?#79) PH7
- (near R?#79) PG8
- (near R?#79) PI5
- PE1
- PE0
- (near R?#79) PI4
- (near U?#4) IS42S32160D-6BLI
- (near U?#4) SDRAM
- Place close SDRAM

### Library data of the parts
C?#5-C?#18 = Cap: Capacitor; Value: 10nF; Published: 8-Jun-2000; Revision: July-2002: Re-released for DXP Platform.; Publisher: Altium Limited
R?#79 = Res1: Resistor; Value: 1K; Published: 8-Jun-2000; Revision: July-2002: Re-released for DXP Platform.; Publisher: Altium Limited
U?#4 = IS42S32160D-6BLI: Manuf_1: ISSI; Fitted: YES; Ordered by: Subcon; ECCN_US/EU: EAR99/NEC; Manuf_Part_1: IS42S32800G-6BLI

## Sheet power.SchDoc
size A3; SheetNumber: 4; SheetTotal: 5
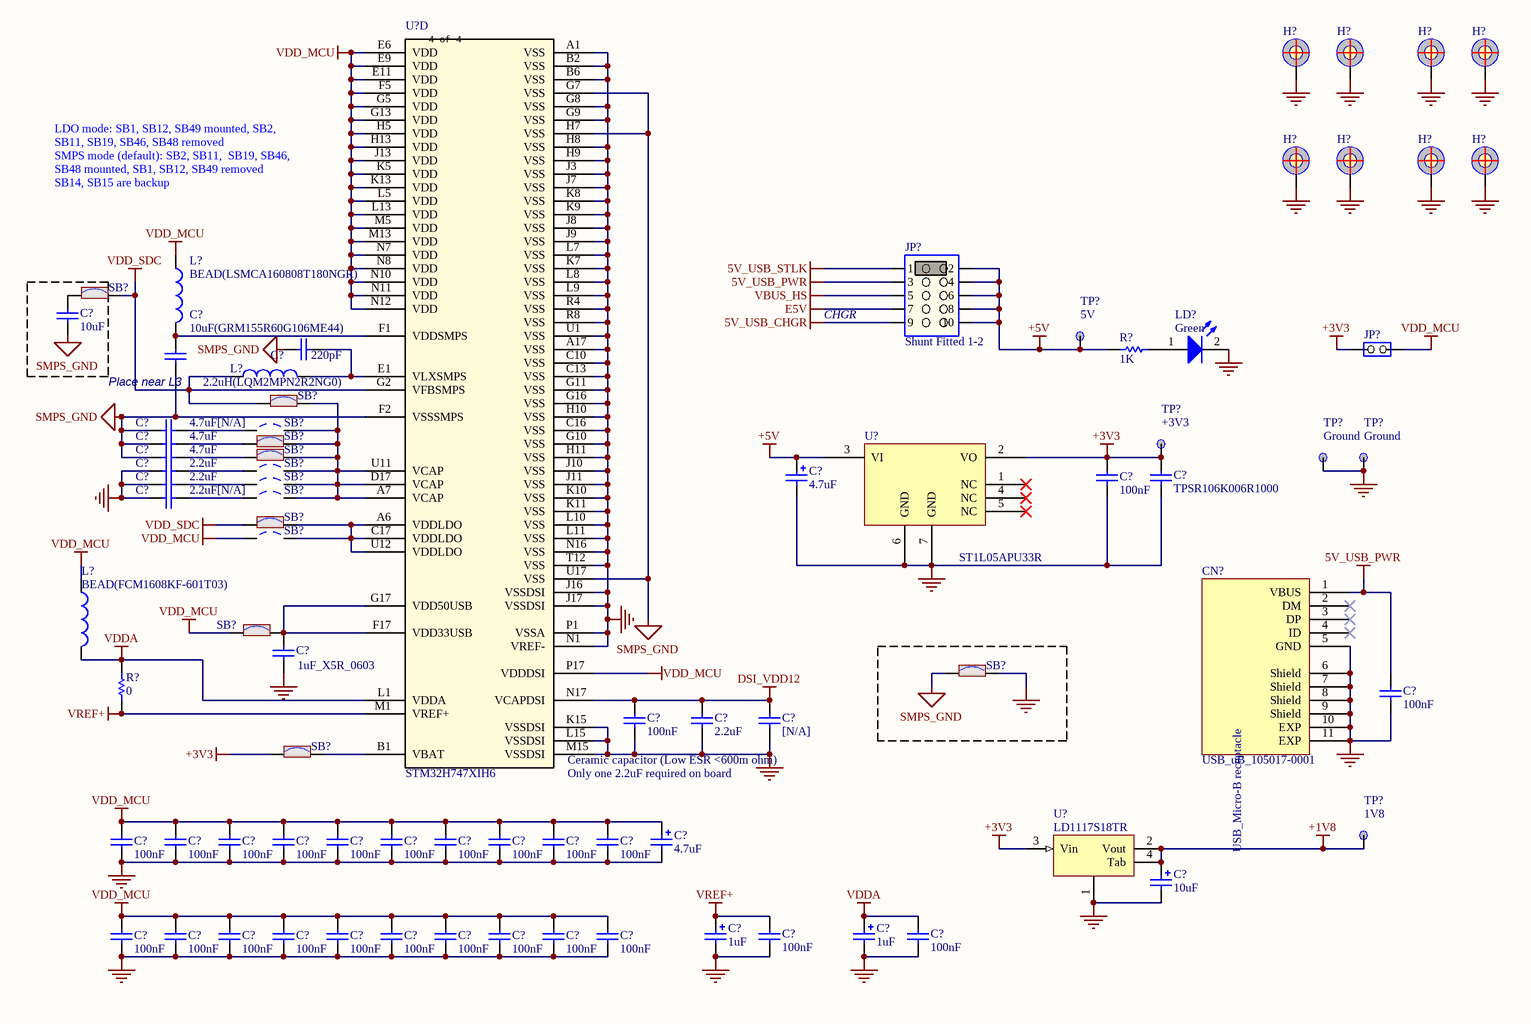
[diagram p4: power.SchDoc]

### Parts
(Parts that share a designator on the sheet are numbered #1, #2 ... from top to bottom, then left to right.)
C?#19  10uF  [CAP_C_1608X80]
C?#20  10uF(GRM155R60G106ME44)  [CAP_C_1608X80]
C?#21  220pF  [CAP_C_1608X80]
C?#22  4.7uF[N/A]  [CAP_C_1608X80]
C?#23  4.7uF  [CAP_C_1608X80]
C?#24  4.7uF  [CAP_C_1608X80]
C?#25  2.2uF  [CAP_C_1608X80]
C?#26  2.2uF  [CAP_C_1608X80]
C?#27  4.7uF  [TAN-A]
C?#28  100nF  [CAP_C_1608X80]
C?#29  2.2uF[N/A]  [CAP_C_1608X80]
C?#30  TPSR106K006R1000  [CAP_C_1608X80]
C?#31  1uF_X5R_0603  [0603C]
C?#32  100nF  [0402C]
C?#33  100nF  [CAP_C_1608X80]
C?#34  2.2uF  [CAP_C_1608X80]
C?#35  [N/A]  [CAP_C_1608X80]
C?#36  100nF  [CAP_C_1608X80]
C?#37  100nF  [CAP_C_1608X80]
C?#38  100nF  [CAP_C_1608X80]
C?#39  100nF  [CAP_C_1608X80]
C?#40  100nF  [CAP_C_1608X80]
C?#41  100nF  [CAP_C_1608X80]
C?#42  100nF  [CAP_C_1608X80]
C?#43  100nF  [CAP_C_1608X80]
C?#44  100nF  [CAP_C_1608X80]
C?#45  100nF  [CAP_C_1608X80]
C?#46  4.7uF  [TAN-A]
C?#47  10uF  [TAN-A]
C?#48  100nF  [CAP_C_1608X80]
C?#49  100nF  [CAP_C_1608X80]
C?#50  100nF  [CAP_C_1608X80]
C?#51  100nF  [CAP_C_1608X80]
C?#52  100nF  [CAP_C_1608X80]
C?#53  100nF  [CAP_C_1608X80]
C?#54  100nF  [CAP_C_1608X80]
C?#55  100nF  [CAP_C_1608X80]
C?#56  100nF  [CAP_C_1608X80]
C?#57  100nF  [CAP_C_1608X80]
C?#58  1uF  [TAN-A]
C?#59  1uF  [TAN-A]
C?#60  100nF  [CAP_C_1608X80]
C?#61  100nF  [CAP_C_1608X80]
CN?  value USB_uB_105017-0001  [MOLEX_1050170001]  (hidden comment: USB_uB_105017.0001)
H?#1  POSITION HOLE C6D3R5  [HOLE_C7D3R5]  (value not drawn)
H?#2  POSITION HOLE C6D3R5  [HOLE_C7D3R5]  (value not drawn)
H?#3  POSITION HOLE C6D3R5  [HOLE_C9D4R5]  (value not drawn)
H?#4  POSITION HOLE C6D3R5  [HOLE_C9D4R5]  (value not drawn)
H?#5  POSITION HOLE C6D3R5  [HOLE_C7D3R5]  (value not drawn)
H?#6  POSITION HOLE C6D3R5  [HOLE_C7D3R5]  (value not drawn)
H?#7  POSITION HOLE C6D3R5  [HOLE_C9D4R5]  (value not drawn)
H?#8  POSITION HOLE C6D3R5  [HOLE_C9D4R5]  (value not drawn)
JP?#1  value Shunt Fitted 1-2  [JP5-D2T]  (hidden comment: Jumper_Header 5x2 Fitted 1-2)
JP?#2  (no value)  [JP2-D1T]
L?#1  BEAD(LSMCA160808T180NGR)  [0603L]
L?#2  2.2uH(LQM2MPN2R2NG0)  [LSM2_VLS2016E_S]
L?#3  BEAD(FCM1608KF-601T03)  [0603L]
LD?  Green  [0603D]
R?#80  1K  [0603R]
R?#81  0  [0603R]
SB?#6  Solder Bridge ON  [Jump2]  (value not drawn)
SB?#7  Solder Bridge ON  [Jump2]  (value not drawn)
SB?#8  Solder Bridge OFF  [SB_0603]  (value not drawn)
SB?#9  Solder Bridge ON  [Jump2]  (value not drawn)
SB?#10  Solder Bridge ON  [Jump2]  (value not drawn)
SB?#11  Solder Bridge OFF  [SB_0603]  (value not drawn)
SB?#12  Solder Bridge OFF  [SB_0603]  (value not drawn)
SB?#13  Solder Bridge OFF  [SB_0603]  (value not drawn)
SB?#14  Solder Bridge ON  [Jump2]  (value not drawn)
SB?#15  Solder Bridge OFF  [SB_0603]  (value not drawn)
SB?#16  Solder Bridge ON  [Jump2]  (value not drawn)
SB?#17  Solder Bridge ON  [Jump2]  (value not drawn)
SB?#18  Solder Bridge ON  [Jump2]  (value not drawn)
TP?#1  5V  [TP_C40]
TP?#2  +3V3  [TP_C40]
TP?#3  Ground  [TP_C40]
TP?#4  Ground  [TP_C40]
TP?#5  1V8  [TP_C40]
U?#5  STM32H747XIH6  [TFBGA240+25]  (part D of 4)
U?#6  ST1L05APU33R  [SON95P300X300X100-7N]
U?#7  LD1117S18TR  [SOT230P700X180-4N]

### Nets
5V_USB_CHGR: JP?#1.9
5V_USB_PWR: C?#32.2 CN?.1(VBUS) JP?#1.3
5V_USB_STLK: JP?#1.1
+1V8: C?#47.1 TP?#5.1 U?#7.2(Vout) U?#7.4(Tab)
+3V3: C?#28.1 C?#30.2 JP?#2.1(COMMON) SB?#18.1 TP?#2.1 U?#6.2(VO) U?#7.3(Vin)
+5V: C?#27.1 JP?#1.2 JP?#1.4 JP?#1.6 JP?#1.8 JP?#1.10 R?#80.2 TP?#1.1 U?#6.3(VI)
DSI_VDD12: C?#33.1 C?#34.1 C?#35.2 U?#5.N17(VCAPDSI)
E5V: JP?#1.7
GND: C?#25.1 C?#26.1 C?#27.2 C?#28.2 C?#29.1 C?#30.1 C?#31.1 C?#32.1 C?#33.2 C?#34.2 C?#35.1 C?#36.2 C?#37.2 C?#38.2 C?#39.2 C?#40.2 C?#41.2 C?#42.2 C?#43.2 C?#44.2 C?#45.2 C?#46.2 C?#47.2 C?#48.2 C?#49.2 C?#50.2 C?#51.2 C?#52.2 C?#53.2 C?#54.2 C?#55.2 C?#56.2 C?#57.2 C?#58.2 C?#59.2 C?#60.1 C?#61.1 CN?.5(GND) CN?.6(Shield) CN?.7(Shield) CN?.8(Shield) CN?.9(Shield) CN?.10(EXP) CN?.11(EXP) H?#1.1 H?#2.1 H?#3.1 H?#4.1 H?#5.1 H?#6.1 H?#7.1 H?#8.1 LD?.2(K) SB?#17.2 TP?#3.1 TP?#4.1 U?#5.A1(VSS) U?#5.A17(VSS) U?#5.B2(VSS) U?#5.B6(VSS) U?#5.C10(VSS) U?#5.C13(VSS) U?#5.C16(VSS) U?#5.G8(VSS) U?#5.G9(VSS) U?#5.G10(VSS) U?#5.G11(VSS) U?#5.G16(VSS) U?#5.H8(VSS) U?#5.H9(VSS) U?#5.H10(VSS) U?#5.H11(VSS) U?#5.J3(VSS) U?#5.J7(VSS) U?#5.J8(VSS) U?#5.J9(VSS) U?#5.J10(VSS) U?#5.J11(VSS) U?#5.J16(VSSDSI) U?#5.J17(VSSDSI) U?#5.K7(VSS) U?#5.K8(VSS) U?#5.K9(VSS) U?#5.K10(VSS) U?#5.K11(VSS) U?#5.K15(VSSDSI) U?#5.L7(VSS) U?#5.L8(VSS) U?#5.L9(VSS) U?#5.L10(VSS) U?#5.L11(VSS) U?#5.L15(VSSDSI) U?#5.M15(VSSDSI) U?#5.N1(VREF-) U?#5.N16(VSS) U?#5.P1(VSSA) U?#5.R4(VSS) U?#5.R8(VSS) U?#5.T12(VSS) U?#5.U1(VSS) U?#6.6(GND) U?#6.7(GND) U?#7.1
SMPS_GND: C?#19.1 C?#20.1 C?#21.2 C?#22.1 C?#23.1 C?#24.1 SB?#17.1 U?#5.F2(VSSSMPS) U?#5.G7(VSS) U?#5.H7(VSS) U?#5.U17(VSS)
VBUS_HS: JP?#1.5
VDD_MCU: C?#36.1 C?#37.1 C?#38.1 C?#39.1 C?#40.1 C?#41.1 C?#42.1 C?#43.1 C?#44.1 C?#45.1 C?#46.1 C?#48.1 C?#49.1 C?#50.1 C?#51.1 C?#52.1 C?#53.1 C?#54.1 C?#55.1 C?#56.1 C?#57.1 JP?#2.2(NO) L?#1.1 L?#3.1 SB?#15.1 SB?#16.1 U?#5.E6(VDD) U?#5.E9(VDD) U?#5.E11(VDD) U?#5.F5(VDD) U?#5.G5(VDD) U?#5.G13(VDD) U?#5.H5(VDD) U?#5.H13(VDD) U?#5.J13(VDD) U?#5.K5(VDD) U?#5.K13(VDD) U?#5.L5(VDD) U?#5.L13(VDD) U?#5.M5(VDD) U?#5.M13(VDD) U?#5.N7(VDD) U?#5.N8(VDD) U?#5.N10(VDD) U?#5.N11(VDD) U?#5.N12(VDD) U?#5.P17(VDDDSI)
VDD_SDC: L?#2.1 SB?#6.2 SB?#7.1 SB?#14.1 U?#5.G2(VFBSMPS)
VDDA: C?#59.1 C?#61.2 L?#3.2 R?#81.1 U?#5.L1(VDDA)
VREF+: C?#58.1 C?#60.2 R?#81.2 U?#5.M1(VREF+)
NetC?#19_2: C?#19.2 SB?#6.1
NetC?#20_2: C?#20.2 L?#1.2 U?#5.F1(VDDSMPS)
NetC?#21_1: C?#21.1 L?#2.2 U?#5.E1(VLXSMPS)
NetC?#22_2: C?#22.2 SB?#8.1
NetC?#23_2: C?#23.2 SB?#9.1
NetC?#24_2: C?#24.2 SB?#10.1
NetC?#25_2: C?#25.2 SB?#11.1
NetC?#26_2: C?#26.2 SB?#12.1
NetC?#29_2: C?#29.2 SB?#13.1
NetC?#31_2: C?#31.2 SB?#16.2 U?#5.F17(VDD33USB) U?#5.G17(VDD50USB)
NetLD?_1: LD?.1(A) R?#80.1
NetSB?#7_2: SB?#7.2 SB?#8.2 SB?#9.2 SB?#10.2 SB?#11.2 SB?#12.2 SB?#13.2 U?#5.A7(VCAP) U?#5.D17(VCAP) U?#5.U11(VCAP)
NetSB?#14_2: SB?#14.2 SB?#15.2 U?#5.A6(VDDLDO) U?#5.C17(VDDLDO) U?#5.U12(VDDLDO)
NetSB?#18_2: SB?#18.2 U?#5.B1(VBAT)

Not connected (* = marked no-connect by the designer): CN? 2(DM)* 3(DP)* 4(ID)*; U?#6 1(NC)* 4(NC)* 5(NC)*

### Notes on the sheet
- LDO mode: SB1, SB12, SB49 mounted, SB2, SB11, SB19, SB46, SB48 removed
  SMPS mode (default): SB2, SB11,  SB19, SB46, SB48 mounted, SB1, SB12, SB49 removed
  SB14, SB15 are backup
- CHGR
- Place near L3
- (near U?#5) Ceramic capacitor (Low ESR <600m ohm)
- (near U?#5) Only one 2.2uF required on board
- (in symbol MCD-00028) USB_Micro-B receptacle
- (in symbol STM32H747XIH6, part D) 4 of 4

### Library data of the parts
C?#19-C?#21 C?#23-C?#26 C?#60 C?#61 = Cap: Capacitor; Value: 10nF; Published: 8-Jun-2000; Revision: July-2002: Re-released for DXP Platform.; Publisher: Altium Limited
C?#22 = cap: Capacitor; Value: 100nF; Ordered by: Subcon; ECCN_US/EU: NA; Fitted: NO; Published: 8-Jun-2000; Revision: July-2002: Re-released for DXP Platform.; Publisher: Altium Limited
C?#27 = Cap Pol1: Polarized Capacitor (Radial); Value: 100pF; Ordered by: Subcon; ECCN_US/EU: NA; Published: 8-Jun-2000; Revision: July-2002: Re-released for DXP Platform.; Publisher: Altium Limited
C?#28 = Cap: Capacitor; Value: 10nF; Ordered by: Subcon; ECCN_US/EU: NA; Published: 8-Jun-2000; Revision: July-2002: Re-released for DXP Platform.; Publisher: Altium Limited
C?#29 = Cap: Capacitor; Value: 10nF; Fitted: NO; Published: 8-Jun-2000; Revision: July-2002: Re-released for DXP Platform.; Publisher: Altium Limited
C?#30 = Cap: Capacitor; Manuf_1: AVX; Ordered by: Subcon; ECCN_US/EU: NA; Revision: V1.0; Manuf_Part_1: TPSR106K006R1000; Value: TPSR106K006R1000
C?#31 = CAP SMD 0603  X5R 1礔 25V 10%: 0603  X5R 1礔; Rated voltage: 25V; Tolerance: 10%; Manufacturer: *; Manufacturer P/N: *; Order code Farnell: 1288202RL; Value: 1礔; Power: *; Technology: X5R; Temperature  Factor: *; Temperature Max: +125癈; Temperature Min: -55癈; STS Code: *
C?#32 = MCD-00016: Capacitor,20pF,50V,NPO,5%,0402; Manufacturer_Part_Number: CC0402JRNPO9BN200; Manufacturer: YAGEO; Provided_By: Subcon; Initial_Board_Reference: mb1274; Internal_Part_Number: MCD-00016; Value: 100nF; Status: Released; Package: 0402; ComponentLink1Description: Yageo_Capacitor_NP0_16V-to-50V.pdf; ECCN_US: n/a; ECCN_EU: n/a; Part_Type: Capacitor
C?#33 C?#36-C?#45 C?#48-C?#57 = CAP: Capacitor; Published: 8-Jun-2000; Revision: July-2002: Re-released for DXP Platform.; Publisher: Altium Limited; Value: 100nF
C?#34 = CAP: Capacitor; Value: 100nF; Published: 8-Jun-2000; Revision: July-2002: Re-released for DXP Platform.; Publisher: Altium Limited
C?#35 = cap: Capacitor; Value: 2.2uF; Ordered by: Subcon; ECCN_US/EU: NA; Fitted: NO; Published: 8-Jun-2000; Revision: July-2002: Re-released for DXP Platform.; Publisher: Altium Limited
C?#46 = Cap Pol1: Polarized Capacitor (Radial); Value: 47uF; Published: 8-Jun-2000; Revision: July-2002: Re-released for DXP Platform.; Publisher: Altium Limited
C?#47 = Cap_10uF_POL_10%_TANA: Polarized Capacitor,10uF,10V,10%,typeA,VISHAY; Manuf_Part_1: 293D106X9010A2TE3; Revision: July-2002: Re-released for DXP Platform.; Value: 10uF; Manuf_1: VISHAY; Order: *; ECCN_US/EU: n/a
C?#58 C?#59 = Cap Pol1: Polarized Capacitor (Radial); Value: 10uF; Published: 8-Jun-2000; Revision: July-2002: Re-released for DXP Platform.; Publisher: Altium Limited
CN? = MCD-00028: USB-MICRO-B, 0.65mm, RA, SMT, Bottom Mount,; Manufacturer_Part_Number: 1050170001; Manufacturer: MOLEX; Part_Type: Connector; Provided_By: Subcon; Initial_Board_Reference: mb1274; Internal_Part_Number: MCD-00028; Status: Released; ComponentLink1Description: Molex_Connector-USB-uB_1050170001.pdf; ECCN_US: n/a; ECCN_EU: n/a
H?#1-H?#8 = POSITION HOLE C6D3R5: Fitted: NO
JP?#1 = MCD-01203: Header, 5x2, 2,54mm, VR, TH, Height 5.84mm/2.54mm - Shunt Fitted 1-2; Part_Type: Connector; Manufacturer_Part_Number: TSW-105-07-x-D; Manufacturer: SAMTEC; Provided_By: Subcon; Initial_Board_Reference: Mb1372; Internal_Part_Number: MCD-01203; Status: Symbol available; ComponentLink1Description: Samtec_TSW-HTSW-series.pdf; ComponentLink1URL: http://tunmcdsvn.tun.st.com/Component_Datasheet_Library/Trunk/Connectors/Samtec_TSW-HTSW-series; ECCN_US: n/a; ECCN_EU: n/a
JP?#2 = JP2
L?#1-L?#3 = Inductor: Value: 100uH; Published: 8-Jun-2000; Revision: July-2002: Re-released for DXP Platform.; Publisher: Altium Limited
  L?#1: MPN: LSMCA160808T180NGR
LD? = LED2: Typical RED, GREEN, YELLOW, AMBER GaAs LED; Published: 8-Jun-2000; Revision: July-2002: Re-released for DXP Platform.; Publisher: Altium Limited
R?#80 = res1: Resistor; Published: 8-Jun-2000; Revision: July-2002: Re-released for DXP Platform.; Publisher: Altium Limited; Value: 1K
R?#81 = Res1: Resistor; Value: 1K; Published: 8-Jun-2000; Revision: July-2002: Re-released for DXP Platform.; Publisher: Altium Limited
SB?#6 SB?#7 SB?#9 SB?#10 SB?#14 SB?#16-SB?#18 = SB_ON: Fitted: YES; Ordered by: Subcon; Revision: July-2002: Re-released for DXP Platform.; ECCN_US/EU: n/a
SB?#8 SB?#11-SB?#13 SB?#15 = SB_OFF: Fitted: NO; Ordered by: Subcon; Revision: July-2002: Re-released for DXP Platform.; ECCN_US/EU: n/a
TP?#1-TP?#5 = TP
U?#5 = STM32H747XIH6: as U?#1 on sheet mcu; Copyright: Copyright (C) 2025 Ultra Librarian. All rights reserved.; Manufacturer_Part_Number: STM32H747XIH6; Datasheet: https://www.st.com/resource/en/datasheet/stm32h747ag.pdf; RefDes: RefDes; Type: Type
U?#6 = ST1L05A: Ordered by: STM; ECCN_US/EU: EAR99/NEC; Fitted: YES; Manuf_1: STM; Manuf_Part_1: ST1L05APU33R
U?#7 = LD1117: Ordered by: STM; ECCN_US/EU: EAR99/NEC; Fitted: YES; Manuf_1: STM; Manuf_Part_1: LD1117S18TR

## Nets that join several sheets
+3V3: TOP (R?#1.1 R?#2.1), mcu (5 pins), sdram (28 pins), power (7 pins)
GND: mcu (10 pins), sdram (28 pins), power (103 pins)
A0: mcu (R?#52.1), sdram (U?#4.G8)
A1: mcu (R?#55.1), sdram (U?#4.G9)
A2: mcu (R?#56.1), sdram (U?#4.F7)
A3: mcu (R?#58.1), sdram (U?#4.F3)
A4: mcu (R?#60.1), sdram (U?#4.G1)
A5: mcu (R?#61.1), sdram (U?#4.G2)
A6: mcu (R?#71.1), sdram (U?#4.G3)
A7: mcu (R?#73.1), sdram (U?#4.H1)
A8: mcu (R?#75.1), sdram (U?#4.H2)
A9: mcu (R?#77.1), sdram (U?#4.J3)
A10: mcu (R?#27.1), sdram (U?#4.G7)
A11: mcu (R?#28.1), sdram (U?#4.H9)
A12: mcu (R?#30.1), sdram (U?#4.H3)
A14: mcu (R?#32.1), sdram (U?#4.J7)
A15: mcu (R?#33.1), sdram (U?#4.H8)
D0: mcu (R?#14.1), sdram (U?#4.R8)
D1: mcu (R?#16.1), sdram (U?#4.N7)
D2: mcu (R?#4.1), sdram (U?#4.R9)
D3: mcu (R?#5.1), sdram (U?#4.N8)
D4: mcu (R?#35.1), sdram (U?#4.P9)
D5: mcu (R?#36.1), sdram (U?#4.M8)
D6: mcu (R?#38.1), sdram (U?#4.M7)
D7: mcu (R?#40.1), sdram (U?#4.L8)
D8: mcu (R?#41.1), sdram (U?#4.L2)
D9: mcu (R?#43.1), sdram (U?#4.M3)
D10: mcu (R?#45.1), sdram (U?#4.M2)
D11: mcu (R?#47.1), sdram (U?#4.P1)
D12: mcu (R?#49.1), sdram (U?#4.N2)
D13: mcu (R?#8.1), sdram (U?#4.R1)
D14: mcu (R?#9.1), sdram (U?#4.N3)
D15: mcu (R?#10.1), sdram (U?#4.R2)
D16: mcu (R?#65.2), sdram (U?#4.E8)
D17: mcu (R?#67.2), sdram (U?#4.D7)
D18: mcu (R?#68.2), sdram (U?#4.D8)
D19: mcu (R?#70.2), sdram (U?#4.B9)
D20: mcu (R?#72.2), sdram (U?#4.C8)
D21: mcu (R?#74.2), sdram (U?#4.A9)
D22: mcu (R?#76.2), sdram (U?#4.C7)
D23: mcu (R?#78.2), sdram (U?#4.A8)
D24: mcu (R?#12.1), sdram (U?#4.A2)
D25: mcu (R?#13.1), sdram (U?#4.C3)
D26: mcu (R?#15.1), sdram (U?#4.A1)
D27: mcu (R?#17.1), sdram (U?#4.C2)
D28: mcu (R?#18.1), sdram (U?#4.B1)
D29: mcu (R?#19.1), sdram (U?#4.D2)
D30: mcu (R?#20.1), sdram (U?#4.D3)
D31: mcu (R?#21.1), sdram (U?#4.E2)
PE0: mcu (U?#3.C4), sdram (U?#4.K9)
PE1: mcu (U?#3.B4), sdram (U?#4.K1)
PF11: mcu (R?#69.1), sdram (U?#4.J9)
PG8: mcu (R?#37.1), sdram (U?#4.J1)
PG15: mcu (R?#50.1), sdram (U?#4.K7)
PH5: mcu (R?#62.2), sdram (U?#4.K8)
PH6: mcu (R?#64.2), sdram (U?#4.J8)
PH7: mcu (U?#3.U13), sdram (R?#79.2)
PI4: mcu (U?#2.A4), sdram (U?#4.F8)
PI5: mcu (U?#2.A3), sdram (U?#4.F2)